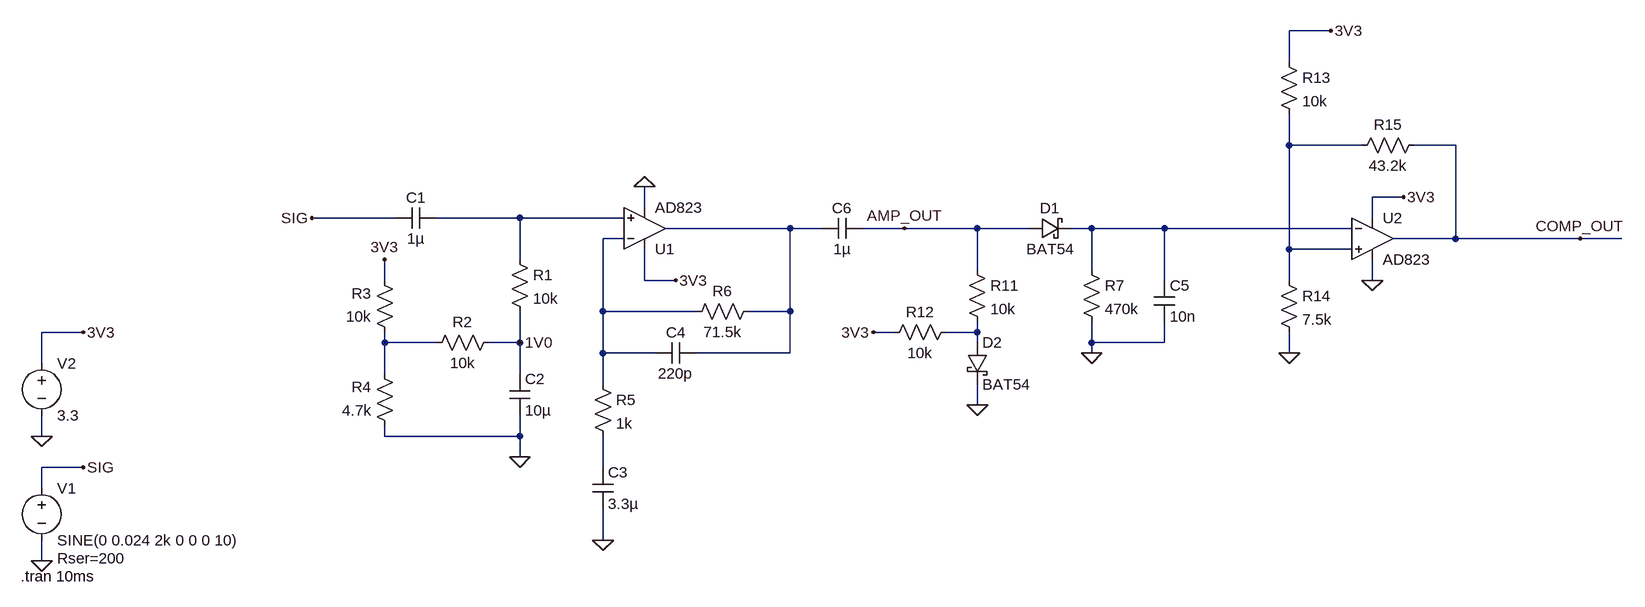
[diagram p0: schematic Sound_detector_wComp.asc]
Sound_detector_wComp.asc, the LTspice schematic file:
Version 4
SHEET 1 2628 712
WIRE 1248 -144 1184 -144
WIRE 1184 -96 1184 -144
WIRE 1184 32 1184 -16
WIRE 1296 32 1184 32
WIRE 1440 32 1376 32
WIRE 1360 112 1312 112
WIRE 192 128 192 96
WIRE -192 144 -320 144
WIRE 0 144 -128 144
WIRE 160 144 0 144
WIRE 1312 144 1312 112
WIRE 416 160 224 160
WIRE 464 160 416 160
WIRE 592 160 528 160
WIRE 704 160 592 160
WIRE 784 160 704 160
WIRE 880 160 848 160
WIRE 992 160 880 160
WIRE 1280 160 992 160
WIRE 160 176 128 176
WIRE 1440 176 1440 32
WIRE 1440 176 1344 176
WIRE 1632 176 1440 176
WIRE 1696 176 1632 176
WIRE 1184 192 1184 32
WIRE 1280 192 1184 192
WIRE 0 208 0 144
WIRE 704 224 704 160
WIRE 880 224 880 160
WIRE -208 240 -208 208
WIRE 192 240 192 192
WIRE 240 240 192 240
WIRE 992 240 992 160
WIRE 1184 240 1184 192
WIRE 1312 240 1312 208
WIRE 128 288 128 176
WIRE 272 288 128 288
WIRE 416 288 416 160
WIRE 416 288 352 288
WIRE -672 320 -736 320
WIRE 576 320 544 320
WIRE 704 320 704 304
WIRE 704 320 656 320
WIRE -208 336 -208 320
WIRE -128 336 -208 336
WIRE 0 336 0 288
WIRE 0 336 -48 336
WIRE 704 336 704 320
WIRE 880 336 880 304
WIRE 992 336 992 304
WIRE 992 336 880 336
WIRE 128 352 128 288
WIRE 208 352 128 352
WIRE 416 352 416 288
WIRE 416 352 272 352
WIRE 880 352 880 336
WIRE 1184 352 1184 320
WIRE -736 368 -736 320
WIRE -208 384 -208 336
WIRE 0 384 0 336
WIRE 128 400 128 352
WIRE 704 432 704 400
WIRE -736 480 -736 448
WIRE -208 480 -208 464
WIRE 0 480 0 448
WIRE 0 480 -208 480
WIRE 0 512 0 480
WIRE -672 528 -736 528
WIRE 128 528 128 480
WIRE -736 560 -736 528
WIRE 128 640 128 592
WIRE -736 672 -736 640
FLAG -736 672 0
FLAG -672 528 SIG
FLAG -320 144 SIG
FLAG 0 512 0
FLAG -736 480 0
FLAG -672 320 3V3
FLAG -208 208 3V3
FLAG 128 640 0
FLAG 592 160 AMP_OUT
FLAG 192 96 0
FLAG 240 240 3V3
FLAG 0 336 1V0
FLAG 880 352 0
FLAG 1360 112 3V3
FLAG 1312 240 0
FLAG 1632 176 COMP_OUT
FLAG 704 432 0
FLAG 544 320 3V3
FLAG 1184 352 0
FLAG 1248 -144 3V3
SYMBOL voltage -736 544 R0
WINDOW 123 0 0 Left 0
WINDOW 39 24 124 Left 2
SYMATTR SpiceLine Rser=200
SYMATTR InstName V1
SYMATTR Value SINE(0 0.024 2k 0 0 0 10)
SYMBOL cap -128 128 R90
WINDOW 0 0 32 VBottom 2
WINDOW 3 32 32 VTop 2
SYMATTR InstName C1
SYMATTR Value 1µ
SYMBOL OpAmps\\AD823 192 224 M180
SYMATTR InstName U1
SYMBOL res -16 192 R0
SYMATTR InstName R1
SYMATTR Value 10k
SYMBOL cap -16 384 R0
SYMATTR InstName C2
SYMATTR Value 10µ
SYMBOL res -32 320 R90
WINDOW 0 0 56 VBottom 2
WINDOW 3 32 56 VTop 2
SYMATTR InstName R2
SYMATTR Value 10k
SYMBOL res -192 336 R180
WINDOW 0 36 76 Left 2
WINDOW 3 36 40 Left 2
SYMATTR InstName R3
SYMATTR Value 10k
SYMBOL res -192 480 R180
WINDOW 0 36 76 Left 2
WINDOW 3 36 40 Left 2
SYMATTR InstName R4
SYMATTR Value 4.7k
SYMBOL voltage -736 352 R0
WINDOW 123 0 0 Left 0
WINDOW 39 0 0 Left 0
SYMATTR InstName V2
SYMATTR Value 3.3
SYMBOL res 112 384 R0
SYMATTR InstName R5
SYMATTR Value 1k
SYMBOL cap 112 528 R0
SYMATTR InstName C3
SYMATTR Value 3.3µ
SYMBOL cap 272 336 R90
WINDOW 0 0 32 VBottom 2
WINDOW 3 32 32 VTop 2
SYMATTR InstName C4
SYMATTR Value 220p
SYMBOL res 368 272 R90
WINDOW 0 0 56 VBottom 2
WINDOW 3 32 56 VTop 2
SYMATTR InstName R6
SYMATTR Value 71.5k
SYMBOL cap 528 144 R90
WINDOW 0 0 32 VBottom 2
WINDOW 3 32 32 VTop 2
SYMATTR InstName C6
SYMATTR Value 1µ
SYMBOL OpAmps\\AD823 1312 112 R0
SYMATTR InstName U2
SYMBOL res 864 208 R0
SYMATTR InstName R7
SYMATTR Value 470k
SYMBOL schottky 784 176 R270
WINDOW 0 32 32 VTop 2
WINDOW 3 0 32 VBottom 2
SYMATTR InstName D1
SYMATTR Value BAT54
SYMATTR Description Diode
SYMATTR Type diode
SYMBOL schottky 688 336 R0
SYMATTR InstName D2
SYMATTR Value BAT54
SYMATTR Description Diode
SYMATTR Type diode
SYMBOL res 688 208 R0
SYMATTR InstName R11
SYMATTR Value 10k
SYMBOL res 672 304 R90
WINDOW 0 0 56 VBottom 2
WINDOW 3 32 56 VTop 2
SYMATTR InstName R12
SYMATTR Value 10k
SYMBOL res 1168 -112 R0
SYMATTR InstName R13
SYMATTR Value 10k
SYMBOL res 1168 224 R0
SYMATTR InstName R14
SYMATTR Value 7.5k
SYMBOL res 1392 16 R90
WINDOW 0 0 56 VBottom 2
WINDOW 3 32 56 VTop 2
SYMATTR InstName R15
SYMATTR Value 43.2k
SYMBOL cap 976 240 R0
SYMATTR InstName C5
SYMATTR Value 10n
TEXT -768 696 Left 2 !.tran 10ms

The netlist it stands for:
* Sound_detector_wComp.asc
V1 SIG 0 SINE(0 0.024 2k 0 0 0 10) Rser=200
C1 N002 SIG 1µ
XU1 N002 N005 3V3 0 N003 AD823  ; pins In+ In- V+ V- OUT
R1 N002 1V0 10k
C2 1V0 0 10µ
R2 1V0 N007 10k
R3 N007 3V3 10k
R4 0 N007 4.7k
V2 3V3 0 3.3
R5 N005 N008 1k
C3 N008 0 3.3µ
C4 N003 N005 220p
R6 N003 N005 71.5k
C6 AMP_OUT N003 1µ
XU2 N001 N004 3V3 0 COMP_OUT AD823  ; pins In+ In- V+ V- OUT
R7 N004 0 470k
D1 AMP_OUT N004 BAT54
D2 N006 0 BAT54
R11 AMP_OUT N006 10k
R12 N006 3V3 10k
R13 3V3 N001 10k
R14 N001 0 7.5k
R15 COMP_OUT N001 43.2k
C5 N004 0 10n
.model D D
.lib standard.dio
.tran 10ms
.lib ADI.lib
.backanno
.end